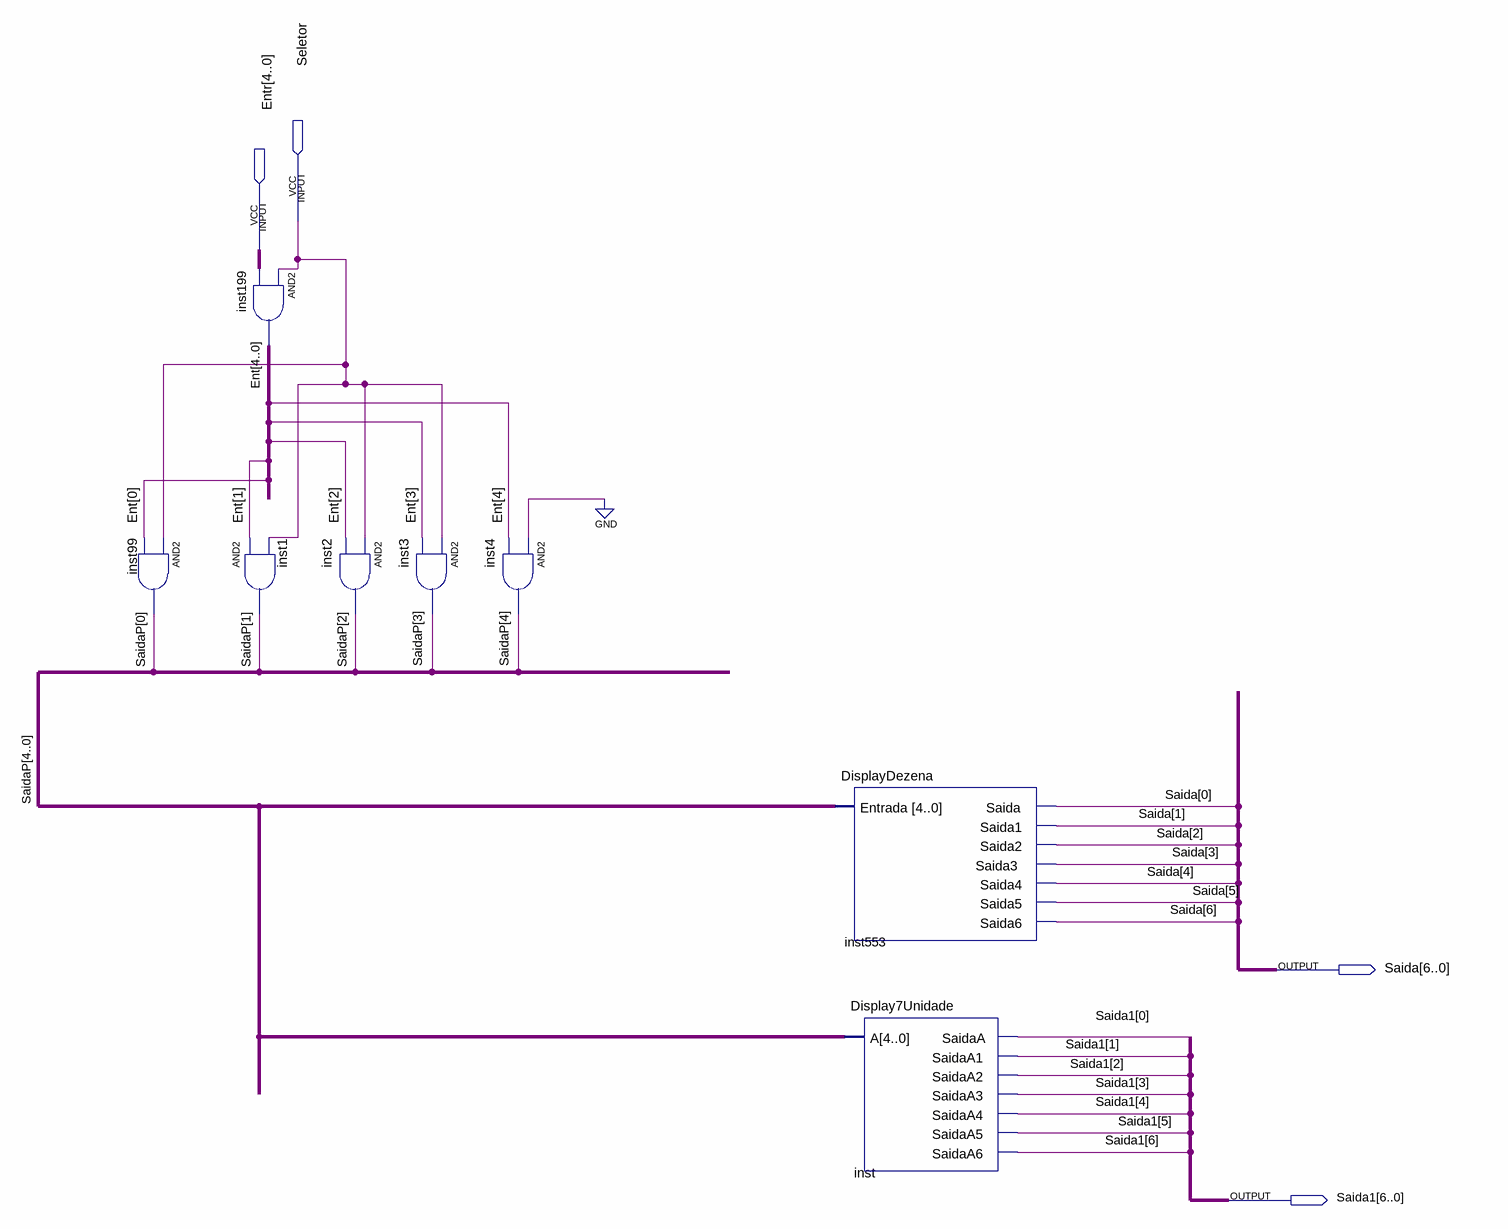
[diagram p0: schematic sheet]
// Quartus schematic DecoderInput.bdf as structural Verilog: 8 symbols, 4 pins
module DecoderInput (
  input  Seletor,
  input  [4:0] Entr,
  output [6:0] Saida,
  output [6:0] Saida1
);

  wire [4:0] Ent, SaidaP;

  and inst99 (SaidaP[0], Seletor, Ent[0]);
  assign Ent = {5{Seletor}} & Entr;  // AND2 inst199, 5 bits wide
  and inst1 (SaidaP[1], Ent[1], Seletor);
  and inst2 (SaidaP[2], Seletor, Ent[2]);
  and inst3 (SaidaP[3], Seletor, Ent[3]);
  and inst4 (SaidaP[4], 1'b0, Ent[4]);
  DisplayDezena inst553 (
    .Entrada(SaidaP), .Saida(Saida[0]), .Saida1(Saida[1]), .Saida2(Saida[2]), .Saida3(Saida[3]),
    .Saida4(Saida[4]), .Saida5(Saida[5]), .Saida6(Saida[6]));
  Display7Unidade inst (
    .A(SaidaP), .SaidaA(Saida1[0]), .SaidaA1(Saida1[1]), .SaidaA2(Saida1[2]), .SaidaA3(Saida1[3]),
    .SaidaA4(Saida1[4]), .SaidaA5(Saida1[5]), .SaidaA6(Saida1[6]));
endmodule
